# Altium schematic sheet Jack.SchDoc
size 152 x 152 mm; SheetNumber: 7; SheetTotal: 7
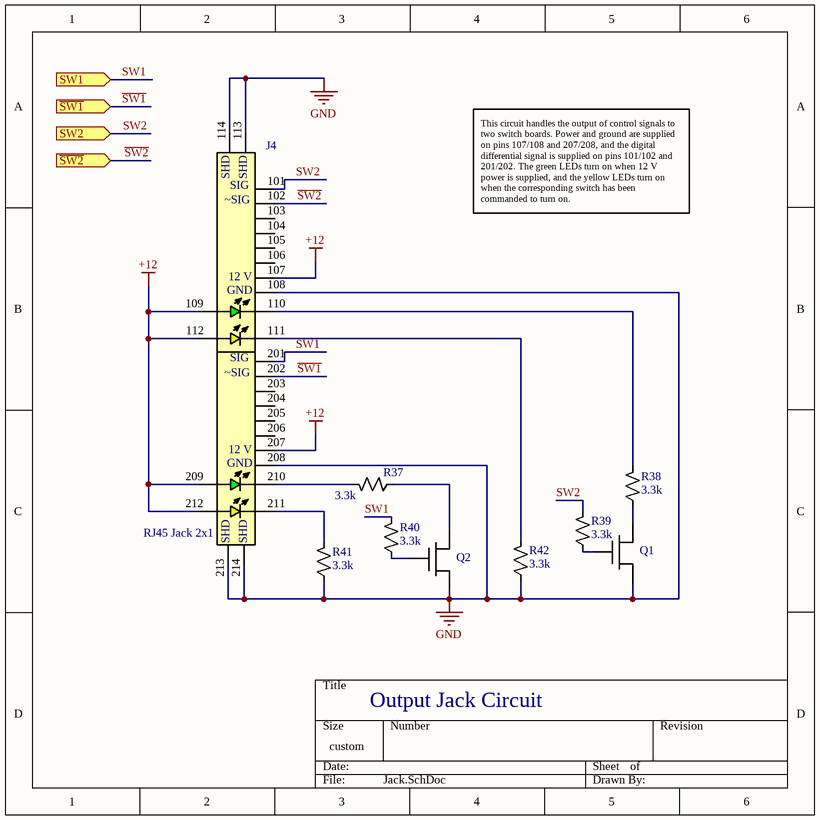
[diagram p0: Jack.SchDoc]

## Parts
J4  RJ45 Jack 2x1  [RJ45_JACK_STACKED]
Q1  Logic FET  [SOT23]  (value not drawn)
Q2  Logic FET  [SOT23]  (value not drawn)
R37  3.3k  [0603_RES]
R38  3.3k  [0603_RES]
R39  3.3k  [0603_RES]
R40  3.3k  [0603_RES]
R41  3.3k  [0603_RES]
R42  3.3k  [0603_RES]

## Ports
SW1 (in, see Jacks[3A]), SW2 (in, see Jacks[3A]), ~{SW1} (in, see Jacks[3A]), ~{SW2} (in, see Jacks[3A])

## Nets
+12: J4.107(12_V) J4.109 J4.112 J4.207(12_V) J4.209 J4.212
GND: J4.108(GND) J4.113(SHD1) J4.114(SHD2) J4.208(GND) J4.213(SHD1) J4.214(SHD2) Q1.3(S) Q2.3(S) R41.1 R42.1
~{SW1}: J4.202(Sig2) ; port ~{SW1}
~{SW2}: J4.102(Sig2) ; port ~{SW2}
SW1: J4.201(Sig1) R40.2 ; port SW1
SW2: J4.101(Sig1) R39.2 ; port SW2
NetJ4_110: J4.110 R38.2
NetJ4_111: J4.111 R42.2
NetJ4_210: J4.210 R37.2
NetJ4_211: J4.211 R41.2
NetQ1_1: Q1.1(D) R38.1
NetQ1_2: Q1.2(G) R39.1
NetQ2_1: Q2.1(D) R37.1
NetQ2_2: Q2.2(G) R40.1

Not connected (* = marked no-connect by the designer): J4 103(NC) 104(NC) 105(NC) 106(NC) 203(NC) 204(NC) 205(NC) 206(NC)

## Notes on the sheet
- This circuit handles the output of control signals to two switch boards. Power and ground are supplied on pins 107/108 and 207/208, and the digital differential signal is supplied on pins 101/102 and 201/202. The green LEDs turn on when 12 V power is supplied, and the yellow LEDs turn on when the corresponding switch has been commanded to turn on.
- Output Jack Circuit
- (in symbol J_RJ45_Jack_2x1_Stack) SHD; SIG; ~SIG

## Library data of the parts
J4 = J_RJ45_Jack_2x1_Stack: Jack RJ-45 8-pin 2x1 Stack
Q1 Q2 = Q_NFET: N-Channel Logic FET SOT23-3
R37-R42 = R_3300Ohm_0603_1%: Resistor 3.3 kOhm 0603 1%